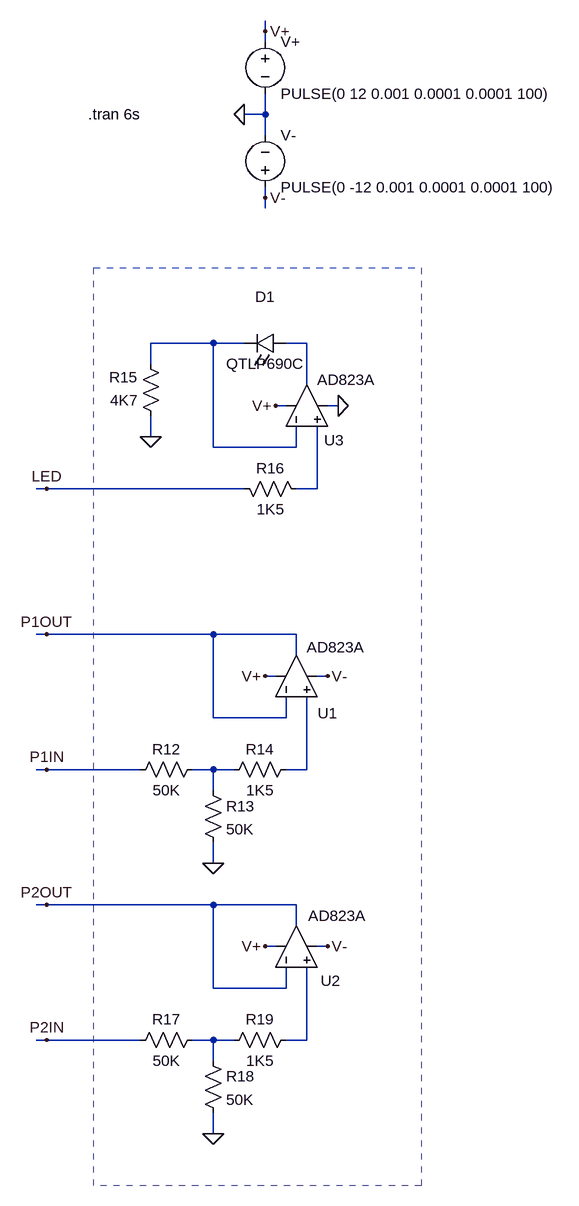
[diagram p0: schematic Motherboard.asc]
Motherboard.asc, the LTspice schematic file:
Version 4
SHEET 1 1408 3424
WIRE -544 -1440 -544 -1456
WIRE -544 -1424 -544 -1440
WIRE -544 -1312 -544 -1344
WIRE -544 -1312 -576 -1312
WIRE -544 -1280 -544 -1312
WIRE -544 -1184 -544 -1200
WIRE -544 -1168 -544 -1184
WIRE -624 -960 -720 -960
WIRE -576 -960 -624 -960
WIRE -480 -960 -512 -960
WIRE -720 -928 -720 -960
WIRE -480 -896 -480 -960
WIRE -512 -864 -528 -864
WIRE -432 -864 -448 -864
WIRE -720 -816 -720 -848
WIRE -624 -800 -624 -960
WIRE -496 -800 -496 -832
WIRE -496 -800 -624 -800
WIRE -880 -736 -896 -736
WIRE -576 -736 -880 -736
WIRE -464 -736 -464 -832
WIRE -464 -736 -496 -736
WIRE -880 -512 -896 -512
WIRE -624 -512 -880 -512
WIRE -496 -512 -624 -512
WIRE -496 -480 -496 -512
WIRE -528 -448 -544 -448
WIRE -448 -448 -464 -448
WIRE -624 -384 -624 -512
WIRE -512 -384 -512 -416
WIRE -512 -384 -624 -384
WIRE -880 -304 -896 -304
WIRE -736 -304 -880 -304
WIRE -624 -304 -656 -304
WIRE -592 -304 -624 -304
WIRE -480 -304 -480 -416
WIRE -480 -304 -512 -304
WIRE -624 -272 -624 -304
WIRE -624 -160 -624 -192
WIRE -880 -96 -896 -96
WIRE -624 -96 -880 -96
WIRE -496 -96 -624 -96
WIRE -496 -64 -496 -96
WIRE -528 -32 -544 -32
WIRE -448 -32 -464 -32
WIRE -624 32 -624 -96
WIRE -512 32 -512 0
WIRE -512 32 -624 32
WIRE -880 112 -896 112
WIRE -736 112 -880 112
WIRE -624 112 -656 112
WIRE -592 112 -624 112
WIRE -480 112 -480 0
WIRE -480 112 -512 112
WIRE -624 144 -624 112
WIRE -624 256 -624 224
FLAG -576 -1312 0
FLAG -544 -1440 V+
FLAG -544 -1184 V-
FLAG -432 -864 0
FLAG -528 -864 V+
FLAG -880 -736 LED
FLAG -448 -448 V-
FLAG -544 -448 V+
FLAG -880 -304 P1IN
FLAG -880 -512 P1OUT
FLAG -624 -160 0
FLAG -448 -32 V-
FLAG -544 -32 V+
FLAG -880 112 P2IN
FLAG -880 -96 P2OUT
FLAG -624 256 0
FLAG -720 -816 0
SYMBOL voltage -544 -1440 R0
SYMATTR InstName V+
SYMATTR Value PULSE(0 12 0.001 0.0001 0.0001 100)
SYMBOL voltage -544 -1184 M180
WINDOW 0 24 96 Left 2
WINDOW 3 24 16 Left 2
SYMATTR InstName V-
SYMATTR Value PULSE(0 -12 0.001 0.0001 0.0001 100)
SYMBOL OpAmps/AD823A -544 -864 R270
WINDOW 3 40 80 VRight 2
WINDOW 0 -53 91 VRight 2
SYMATTR InstName U3
SYMBOL Res -480 -720 M270
WINDOW 0 32 56 VTop 2
WINDOW 3 0 56 VBottom 2
SYMATTR InstName R16
SYMATTR Value 1K5
SYMBOL Res -704 -832 R180
WINDOW 0 36 76 Left 2
WINDOW 3 36 40 Left 2
SYMATTR InstName R15
SYMATTR Value 4K7
SYMBOL LED -512 -944 M270
WINDOW 0 72 32 VTop 2
WINDOW 3 0 32 VBottom 2
SYMATTR InstName D1
SYMATTR Value QTLP690C
SYMBOL OpAmps/AD823A -560 -448 R270
WINDOW 3 44 80 VRight 2
WINDOW 0 -57 97 VRight 2
SYMATTR InstName U1
SYMBOL Res -752 -288 R270
WINDOW 0 32 56 VTop 2
WINDOW 3 0 56 VBottom 2
SYMATTR InstName R12
SYMATTR Value 50K
SYMBOL Res -640 -288 R0
SYMATTR InstName R13
SYMATTR Value 50K
SYMBOL Res -496 -320 R90
WINDOW 0 0 56 VBottom 2
WINDOW 3 32 56 VTop 2
SYMATTR InstName R14
SYMATTR Value 1K5
SYMBOL OpAmps/AD823A -560 -32 R270
WINDOW 3 47 82 VRight 2
WINDOW 0 -53 101 VRight 2
SYMATTR InstName U2
SYMBOL Res -752 128 R270
WINDOW 0 32 56 VTop 2
WINDOW 3 0 56 VBottom 2
SYMATTR InstName R17
SYMATTR Value 50K
SYMBOL Res -640 128 R0
SYMATTR InstName R18
SYMATTR Value 50K
SYMBOL Res -496 96 R90
WINDOW 0 0 56 VBottom 2
WINDOW 3 32 56 VTop 2
SYMATTR InstName R19
SYMATTR Value 1K5
TEXT -816 -1312 Left 2 !.tran 6s
RECTANGLE Normal -808 -1076 -304 336 2

The netlist it stands for:
* Motherboard.asc
V+ V+ 0 PULSE(0 12 0.001 0.0001 0.0001 100)
V- V- 0 PULSE(0 -12 0.001 0.0001 0.0001 100)
XU3 N003 N001 V+ 0 N002 AD823A  ; pins In+ In- V+ V- OUT
R16 N003 LED 1K5
R15 0 N001 4K7
D1 N002 N001 QTLP690C
XU1 N005 P1OUT V+ V- P1OUT AD823A  ; pins In+ In- V+ V- OUT
R12 P1IN N004 50K
R13 N004 0 50K
R14 N005 N004 1K5
XU2 N007 P2OUT V+ V- P2OUT AD823A  ; pins In+ In- V+ V- OUT
R17 P2IN N006 50K
R18 N006 0 50K
R19 N007 N006 1K5
.model D D
.lib standard.dio
.tran 6s
.backanno
.end